# EAGLE design PCBCompost (EAGLE 9.6.2)
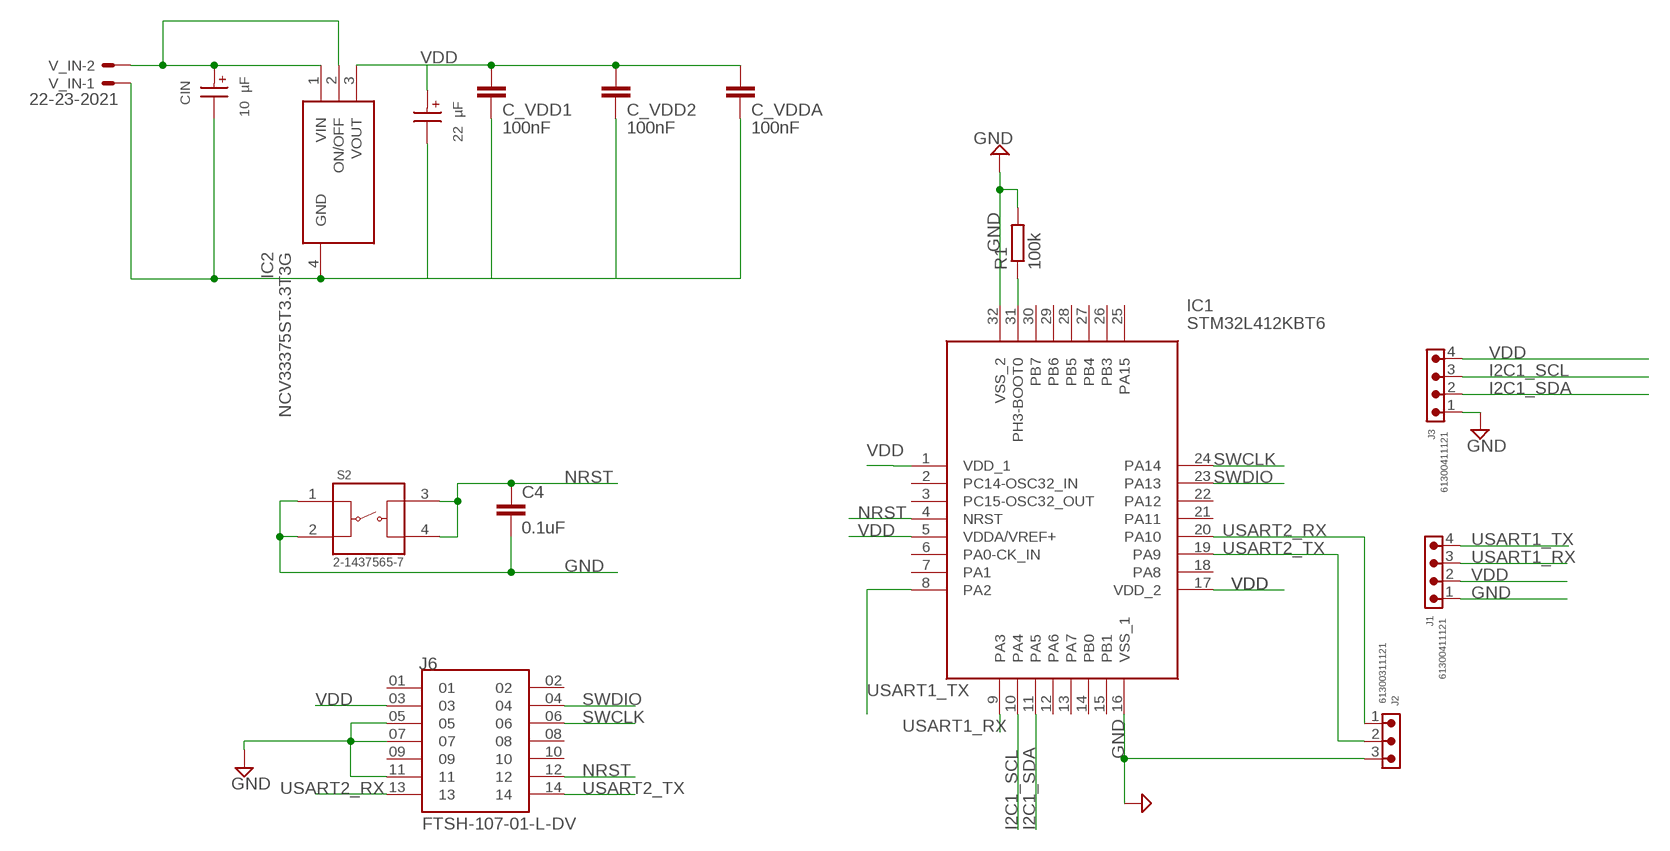
[diagram p0: schematic, sheet 1]

## Parts
C4  0.1uF  C-EUC0603  [C0603]
C_VDD1  100nF  C-EUC0603  [C0603]
C_VDD2  100nF  C-EUC0603  [C0603]
C_VDDA  100nF  C-EUC0603  [C0603]
CIN  10 µF  WCAP-ASLL_4X5.5_865060440001  [WCAP-ASLL_4X5.5(DXL)]
COUT  22 µF  WCAP-ASLL_5X5.5_865060442002  [WCAP-ASLL_5X5.5(DXL)]
IC1  STM32L412KBT6  [QFP80P900X900X160-32N]
IC2  NCV33375ST3.3T3G  [SOT230P700X175-4N]
J1  61300411121  6130XX11121_61300411121  [61300411121]
J2  61300311121  6130XX11121_61300311121  [61300311121]
J3  61300411121  6130XX11121_61300411121  [61300411121]
J6  FTSH-107-01-L-DV  [SAMTEC_FTSH-107-01-L-DV]
R1  100k  R-EU_R0603  [R0603]
S2  2-1437565-7  [SW_2-1437565-7]
V_IN  22-23-2021  [22-23-2021]

## Nets
GND: C4.2 C_VDD1.2 C_VDD2.2 C_VDDA.2 CIN.2(-) COUT.2(-) IC1.16(VSS_1) IC1.32(VSS_2) IC2.4(GND) J1.1 J2.3 J3.1 J6.05 J6.07 J6.11 R1.2 S2.1 S2.2 V_IN.1
I2C1_SCL: IC1.10(PA4) J3.3
I2C1_SDA: IC1.11(PA5) J3.2
N$1: IC1.31(PH3-BOOT0) R1.1
N$10: CIN.1(+) IC2.1(VIN) IC2.2(ON/OFF) V_IN.2
NRST: C4.1 IC1.4(NRST) J6.12 S2.3 S2.4
SWCLK: IC1.24(PA14) J6.06
SWDIO: IC1.23(PA13) J6.04
USART1_RX: IC1.9(PA3) J1.3
USART1_TX: IC1.8(PA2) J1.4
USART2_RX: IC1.20(PA10) J2.1 J6.13
USART2_TX: IC1.19(PA9) J2.2 J6.14
VDD: C_VDD1.1 C_VDD2.1 C_VDDA.1 COUT.1(+) IC1.1(VDD_1) IC1.5(VDDA/VREF+) IC1.17(VDD_2) IC2.3(VOUT) J1.2 J3.4 J6.03
Unconnected: IC1.2(PC14-OSC32_IN) IC1.3(PC15-OSC32_OUT) IC1.6(PA0-CK_IN) IC1.7(PA1) IC1.12(PA6) IC1.13(PA7) IC1.14(PB0) IC1.15(PB1) IC1.18(PA8) IC1.21(PA11) IC1.22(PA12) IC1.25(PA15) IC1.26(PB3) IC1.27(PB4) IC1.28(PB5) IC1.29(PB6) IC1.30(PB7) J6.01 J6.02 J6.08 J6.09 J6.10

## Library data of the parts
C4 C_VDD1 C_VDD2 C_VDDA = rcl:C-EU: CAPACITOR, European symbol; SPICEPREFIX: C
CIN = cin:WCAP-ASLL_4X5.5: WCAP-ASLL Aluminium Electrolytic Capacitors Low Impedance & Long Life +105 °C Characteristics Low impedance and long life product series Mounting style: V-Chip SMT Capacitance range: 1 µF ‒ 6800 µF Capacitance tolerance: ±20 % Voltage range (UR): 6.3 ‒ 450 V(DC) Operating temperature: -55 °C up to +105 °C for UR ≤ 100 V(DC) -40 °C up to +105 °C for UR > 100 V(DC) Endurance: 2000 ‒ 5000 h @ +105 °C Dimensions (DxL) in mm: 4.0 x 5.5 up to 16.0 x 17.0 Recommended soldering: Reflow soldering Applications Long life application & low impedance Input and output capacitor for switched-mode power supply Filtering Smoothing e.g. DC/DC converter, AC/DC converter, satellite receiver, control panel <https://www.we-online.com/catalog/media/o14724v209%20Family_WCAP-ASLL.jpg> Details see: https://www.we-online.com/catalog/en/WCAP-ASLL/ Updated by yingchun,Shan;2020-03-03 2020(C) Würth Elektronik; DATASHEET-URL: https://www.we-online.com/catalog/datasheet/865060440001.pdf; DF: 14%; DIAMETER: 4mm; I-LEAK: 3uA; I-RIPPLE: 90mA; L: 5.5mm; OPERATING-TEMPERATURE: -55 °C up to +105 °C; PART-NUMBER: 865060440001; TECHNICAL-REFERENCE: ASEB055100M025DVCTAB000; VR: 25V(DC); Z: 1.35Ohm
COUT = cout:WCAP-ASLL_5X5.5: WCAP-ASLL Aluminium Electrolytic Capacitors Low Impedance & Long Life +105 °C Characteristics Low impedance and long life product series Mounting style: V-Chip SMT Capacitance range: 1 µF ‒ 6800 µF Capacitance tolerance: ±20 % Voltage range (UR): 6.3 ‒ 450 V(DC) Operating temperature: -55 °C up to +105 °C for UR ≤ 100 V(DC) -40 °C up to +105 °C for UR > 100 V(DC) Endurance: 2000 ‒ 5000 h @ +105 °C Dimensions (DxL) in mm: 4.0 x 5.5 up to 16.0 x 17.0 Recommended soldering: Reflow soldering Applications Long life application & low impedance Input and output capacitor for switched-mode power supply Filtering Smoothing e.g. DC/DC converter, AC/DC converter, satellite receiver, control panel <https://www.we-online.com/catalog/media/o14724v209%20Family_WCAP-ASLL.jpg> Details see: https://www.we-online.com/catalog/en/WCAP-ASLL/ Updated by yingchun,Shan;2020-03-03 2020(C) Würth Elektronik; DATASHEET-URL: https://www.we-online.com/catalog/datasheet/865060442002.pdf; DF: 14%; DIAMETER: 5mm; I-LEAK: 5.5uA; I-RIPPLE: 150mA; L: 5.5mm; OPERATING-TEMPERATURE: -55 °C up to +105 °C; PART-NUMBER: 865060442002; TECHNICAL-REFERENCE: ASEC055220M025DVCTBB000; VR: 25V(DC); Z: 0.8Ohm
IC1 = STM32_librairy:STM32L412KBT6: ARM Microcontrollers - MCU Ultra-low-power Arm Cortex -M4 32-bit MCU+FPU, 100DMIPS up to 128KB Flash, 40KB SRAM, analog, ext. SMPS Source: Datasheet; DESCRIPTION: ARM Microcontrollers - MCU Ultra-low-power Arm Cortex -M4 32-bit MCU+FPU, 100DMIPS up to 128KB Flash, 40KB SRAM, analog, ext. SMPS; HEIGHT: 1.6mm; MANUFACTURER_NAME: STMicroelectronics; MANUFACTURER_PART_NUMBER: STM32L412KBT6; MOUSER_PART_NUMBER: 511-STM32L412KBT6; MOUSER_PRICE-STOCK: https://www.mouser.co.uk/ProductDetail/STMicroelectronics/STM32L412KBT6?qs=%252BEew9%252B0nqrD6o08jV%2F00TA%3D%3D
IC2 = SamacSys_Parts:NCV33375ST3.3T3G: ON SEMICONDUCTOR - NCV33375ST3.3T3G - Fixed LDO Voltage Regulator, 4.3V to 13V, 260mV Dropout, 3.3Vout, 300mAout, SOT-223-4 Source: Datasheet <http://www.onsemi.com/pub/Collateral/MC33375-D.PDF>; DESCRIPTION: ON SEMICONDUCTOR - NCV33375ST3.3T3G - Fixed LDO Voltage Regulator, 4.3V to 13V, 260mV Dropout, 3.3Vout, 300mAout, SOT-223-4; HEIGHT: 1.75mm; MANUFACTURER_NAME: onsemi; MANUFACTURER_PART_NUMBER: NCV33375ST3.3T3G; MOUSER_PART_NUMBER: 863-NCV33375ST3.3T3G; MOUSER_PRICE-STOCK: https://www.mouser.co.uk/ProductDetail/ON-Semiconductor/NCV33375ST33T3G?qs=Pqj8oIac8rWOl%252BM3OwXrOg%3D%3D
J1 J3 = Eagle_WR-PHD (rev21a):6130XX11121_61300411121: WR-PHD 2.54 mm THT Pin Header ARTICLE PROPERTIES: Pins:1;​ 2;​ 3;​ 4;​ 5;​ 6;​ 7;​ 8;​ 9;​ 10;​ 12;​ 13;​ 14;​ 15;​ 16;​ 18;​ 20;​ 22;​ 24;​ 25;​ 32;​ 36;​ 40 KIND PROPERTIES: Pitch：2.54 mm Quality Class:3 as per CECC 75 301-802 Rows：Single Gender：Pin Header Type：Straight MATERIAL PROPERTIES: Insulator Material :PBT Insulator Flammability Rating:UL94 V-0 Contact Material:Copper Alloy Contact Plating:Gold Contact Type:Stamped GENERAL INFORMATION Operating Temperature:-40 up to +105 °C Compliance:RoHS ELECTRICAL PROPERTIES: Rated Current:3 A IR 1:3 A Withstanding Voltage:500 V (AC) Contact Resistance:20 mΩ RISO:1000 MΩ CERTIFICATION UL Approval:E323964 PACKAGING PROPERTIES Packaging:Bag <https://katalog.we-online.com/media/images/v2/o33211v209%20Family_BTB_PHD_6130xx11121.jpg> Details see: https://katalog.we-online.com/en/em/PHD_2_54_THT_PIN_HEADER_6130XX11121 Updated by Yingchun,Shan 2019-10-16 2019 (C) Würth Elektronik; DATASHEET-URL: https://www.we-online.com/catalog/datasheet/61300411121.pdf; GENDER: Pin Header; IR: 3A; MOUNT: THT; PACKAGING: Bag; PART-NUMBER: 61300411121; PINS: 4; PITCH: 2.54mm; ROWS: Single; TYPE: Straight
J2 = Eagle_WR-PHD (rev21a):6130XX11121_61300311121: WR-PHD 2.54 mm THT Pin Header ARTICLE PROPERTIES: Pins:1;​ 2;​ 3;​ 4;​ 5;​ 6;​ 7;​ 8;​ 9;​ 10;​ 12;​ 13;​ 14;​ 15;​ 16;​ 18;​ 20;​ 22;​ 24;​ 25;​ 32;​ 36;​ 40 KIND PROPERTIES: Pitch：2.54 mm Quality Class:3 as per CECC 75 301-802 Rows：Single Gender：Pin Header Type：Straight MATERIAL PROPERTIES: Insulator Material :PBT Insulator Flammability Rating:UL94 V-0 Contact Material:Copper Alloy Contact Plating:Gold Contact Type:Stamped GENERAL INFORMATION Operating Temperature:-40 up to +105 °C Compliance:RoHS ELECTRICAL PROPERTIES: Rated Current:3 A IR 1:3 A Withstanding Voltage:500 V (AC) Contact Resistance:20 mΩ RISO:1000 MΩ CERTIFICATION UL Approval:E323964 PACKAGING PROPERTIES Packaging:Bag <https://katalog.we-online.com/media/images/v2/o33211v209%20Family_BTB_PHD_6130xx11121.jpg> Details see: https://katalog.we-online.com/en/em/PHD_2_54_THT_PIN_HEADER_6130XX11121 Updated by Yingchun,Shan 2019-10-16 2019 (C) Würth Elektronik; DATASHEET-URL: https://www.we-online.com/catalog/datasheet/61300311121.pdf; GENDER: Pin Header; IR: 3A; MOUNT: THT; PACKAGING: Bag; PART-NUMBER: 61300311121; PINS: 3; PITCH: 2.54mm; ROWS: Single; TYPE: Straight
J6 = FTSH-107-01-L-DV:FTSH-107-01-L-DV; MANUFACTURER: Samtec; PARTREV: R; STANDARD: Manufacturer Recommendations
R1 = rcl:R-EU_: RESISTOR, European symbol; SPICEPREFIX: R
S2 = 2-1437565-7:2-1437565-7: FSM2JSMA=SMT,TACTILE,PB SWITCH Check availability <https://pricing.snapeda.com/parts/FSM2JSMA/TE%20Connectivity/view-part?ref=eda>; AVAILABILITY: In Stock; COMMENT: 2-1437565-7; CONFIGURATION_POLE-THROW: Single Pole - Single Throw; CONTACT_CURRENT_RATING: 50 mA; DESCRIPTION: Tactile Switch SPST-NO Top Actuated Surface Mount; MF: TE Connectivity; MP: FSM2JSMA; PACKAGE: None; PRICE: None; PURCHASE-URL: https://pricing.snapeda.com/search/part/FSM2JSMA/?ref=eda
V_IN = con-molex:22-23-2021: .100" (2.54mm) Center Header - 2 Pin; MF: MOLEX; MPN: 22-23-2021; OC_FARNELL: 1462926; OC_NEWARK: 25C3832

## Board
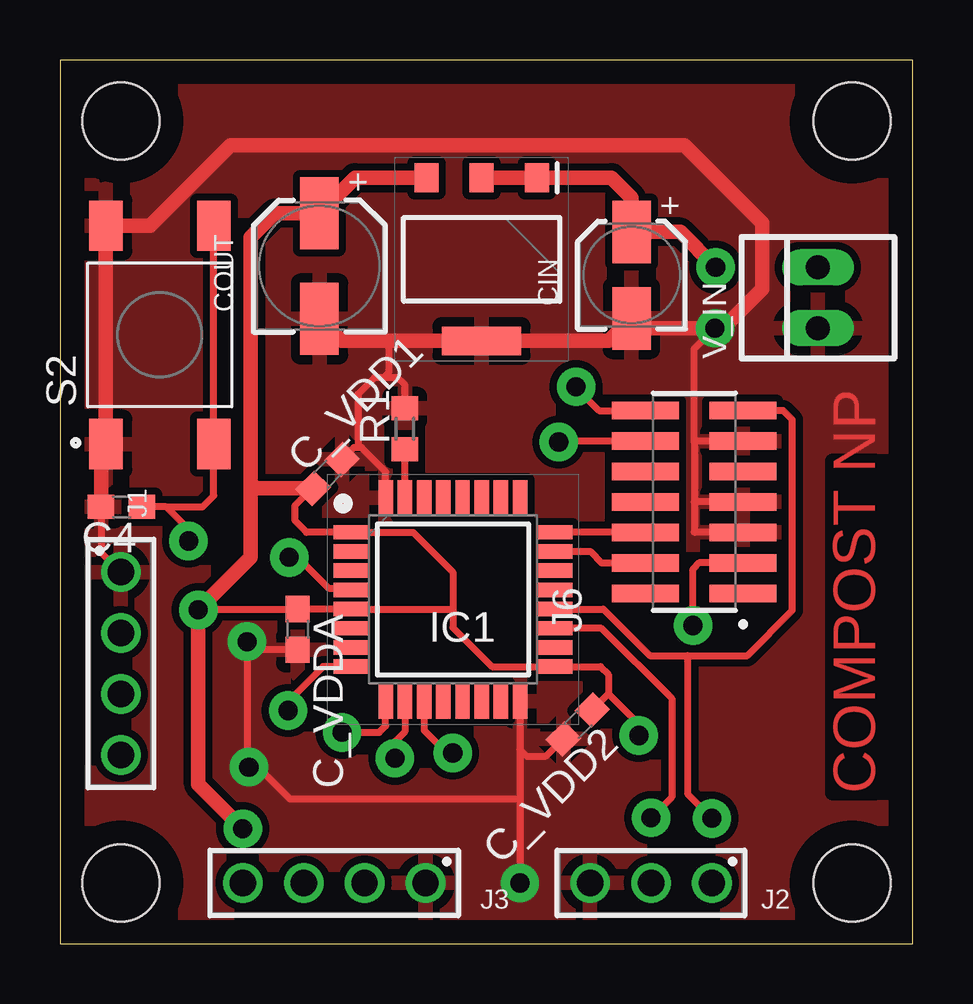
[diagram p1: board, top side]
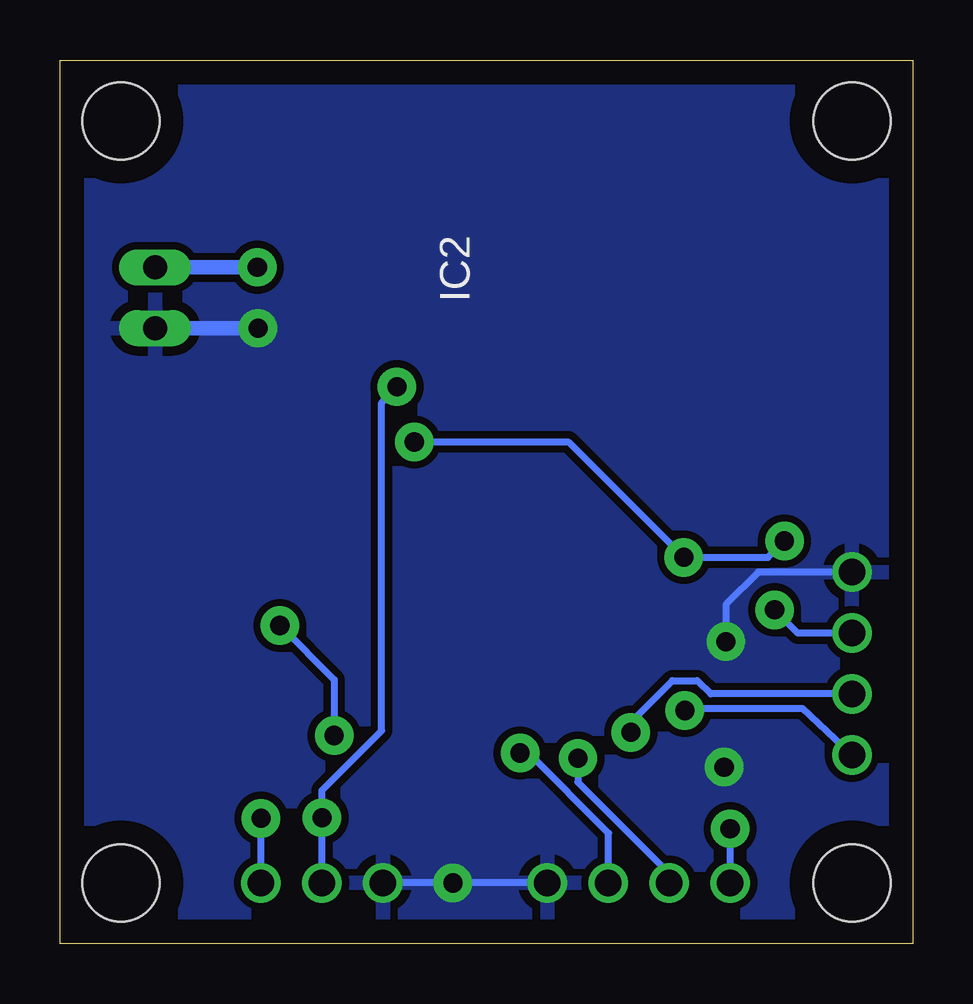
[diagram p2: board, bottom side, seen from below]

Size 35.56 x 36.83 mm. Coordinates in mm from the lower left corner, seen from the top.
Outline: 0,0 35.56,0 35.56,36.83 0,36.83 0,0
Copper layers (1*16): Top 0.035mm / dielectric 1.6mm / Bottom 0.035mm
Design rules "ENSEA_2022_04_08 *": minimum track width 0.3mm, minimum drill 0.8mm, track to track 0.3mm, track to pad 0.3mm, pad to pad 0.3mm, via to via 0.8mm, smd to smd 0.3mm, copper to edge 1mm, drill to drill 0.4mm, minimum pad ring 0.2mm, minimum via ring 0.2mm, stop-mask expansion 4mil, vias tented up to drill 0mil, thermal gap 0.4mm
Holes 3.2 mm at 2.54,2.54 2.54,34.29 33.02,34.29 33.02,2.54

### Footprints (pad centres in the part's own frame; a part is rotated, then mirrored left to right if it is on the bottom)
C0603 = smd 1.1 x 1: 1 -0.85,0; 2 0.85,0
WCAP-ASLL_4X5.5(DXL) = smd 2.6 x 1.6: 1 1.8,0; 2 -1.8,0
WCAP-ASLL_5X5.5(DXL) = smd 3 x 1.6: 1 2.2,0; 2 -2.2,0
QFP80P900X900X160-32N = smd 1.475 x 0.6: 1 -4.238,2.8; 2 -4.238,2; 3 -4.238,1.2; 4 -4.238,0.4; 5 -4.238,-0.4; 6 -4.238,-1.2; 7 -4.238,-2; 8 -4.238,-2.8; 17 4.238,-2.8; 18 4.238,-2; 19 4.238,-1.2; 20 4.238,-0.4; 21 4.238,0.4; 22 4.238,1.2; 23 4.238,2; 24 4.238,2.8 | smd 0.6 x 1.475: 9 -2.8,-4.238; 10 -2,-4.238; 11 -1.2,-4.238; 12 -0.4,-4.238; 13 0.4,-4.238; 14 1.2,-4.238; 15 2,-4.238; 16 2.8,-4.238; 25 2.8,4.238; 26 2,4.238; 27 1.2,4.238; 28 0.4,4.238; 29 -0.4,4.238; 30 -1.2,4.238; 31 -2,4.238; 32 -2.8,4.238
SOT230P700X175-4N = smd 1.2 x 1: 1 -3.4,2.3; 2 -3.4,0; 3 -3.4,-2.3 | smd 1.2 x 3.3: 4 3.4,0
61300411121 = drill 1.1: 1 -3.81,0; 2 -1.27,0; 3 1.27,0; 4 3.81,0
61300311121 = drill 1.1: 1 -2.54,0; 2 0,0; 3 2.54,0
SAMTEC_FTSH-107-01-L-DV = smd 0.74 x 2.79: 01 -3.81,-2.035; 02 -3.81,2.035; 03 -2.54,-2.035; 04 -2.54,2.035; 05 -1.27,-2.035; 06 -1.27,2.035; 07 0,-2.035; 08 0,2.035; 09 1.27,-2.035; 10 1.27,2.035; 11 2.54,-2.035; 12 2.54,2.035; 13 3.81,-2.035; 14 3.81,2.035
R0603 = smd 1 x 1.1: 1 -0.85,0; 2 0.85,0
SW_2-1437565-7 = smd 2.1 x 1.4: 1 -4.55,2.25; 2 4.55,2.25; 3 -4.55,-2.25; 4 4.55,-2.25
22-23-2021 = drill 1 long: 1 -1.27,0; 2 1.27,0

### Placement (x,y rotation side)
C4  2.57,18.21 180 top
C_VDD1  11.15,19.58 45 top
C_VDD2  21.59,9.14 225 top
C_VDDA  9.91,13.11 270 top
CIN  23.83,27.86 90 top
COUT  10.82,28.24 90 top
IC1  16.38,14.35 0 top
IC2  17.58,28.52 270 top
J1  2.54,11.68 270 top
J2  24.64,2.54 180 top
J3  11.43,2.54 180 top
J6  26.44,18.41 90 top
R1  14.38,21.46 90 top
S2  4.17,25.37 90 top
V_IN  31.6,26.92 90 top

### Tracks (layer width: path | path; a pad name or v marks a point on that pad's centre or on a via)
GND  (via drill 0.8 pad 1.6)
  Top 0.3: IC1.16 19.18,8.1 | 19.18,8.1 19.46,7.82 20.27,7.82 C_VDD2.2 | IC1.32 13.58,19.67 12.57,20.68 12.42,20.68 | C_VDD1.2 12.24,20.68 12.42,20.68 | R1.2 14.38,23.29 14.07,23.6 13.49,23.6 | 13.49,23.6 13.11,23.6 12.42,22.91 12.42,20.68 | J6.07 26.44,18.41 | J6.11 26.49,20.95 26.44,20.9 | 26.44,20.9 26.44,18.41 | 26.44,18.41 26.44,17.17 26.47,17.14 J6.05 | 1.92,18.41 C4.2 1.72,16.31 2.53,15.49 J1.1 | 19.18,8.1 19.18,8.09 19.18,6.04 | 19.18,6.04 v19.18,2.54 | C_VDDA.2 8.13,12.26 v7.8,12.59 7.8,7.82 9.58,6.04 19.18,6.04 | 13.49,23.6 13.72,23.82 13.72,25.12 | v27.3,25.65 26.44,24.79 26.44,20.9
  Top 0.6: 23.7,25.93 22.89,25.12 IC2.4 13.72,25.12 11.74,25.12 COUT.2 | 23.7,25.93 CIN.2 | 23.7,25.93 23.98,25.65 v27.3,25.65 27.64,25.65 29.29,27.3 29.29,30.02 26.03,33.28 7.12,33.28 3.77,29.93 S2.2 1.92,21.26 | 1.92,21.26 S2.1 | C4.2 1.72,21.06 1.92,21.26
  Bottom 0.3: J3.1 v19.18,2.54 J2.3 | J1.1 6.45,15.49 7.8,14.15 v7.8,12.59
  Bottom 0.6: V_IN.1 v27.3,25.65
  other vias: 7.87,7.37
  pour Top: 0,0 35.56,0 35.56,36.83 0,36.83
  pour Bottom: 0,0 35.56,0 35.56,36.83 0,36.83
I2C1_SCL  (via drill 0.8 pad 1.6)
  Top 0.3: IC1.10 14.38,8.85 13.97,8.43 v13.97,7.74
  Bottom 0.3: v13.97,7.74 13.97,6.74 10.16,2.93 J3.3
I2C1_SDA  (via drill 0.8 pad 1.6)
  Top 0.3: IC1.11 15.18,8.9 16.12,7.96 v16.38,7.96
  Bottom 0.3: J3.2 12.69,4.61 16.03,7.96 v16.38,7.96
N$1
  Top 0.3: IC1.31 R1.1
N$10  (via drill 0.8 pad 1.6)
  Top 0.6: IC2.2 IC2.1 22.99,31.92 23.82,31.09 CIN.1 25.86,29.66 v27.33,28.19
  Bottom 0.6: V_IN.2 v27.33,28.19
NRST  (via drill 0.8 pad 1.6)
  Top 0.3: 6.2,29.71 S2.4 S2.3 6.42,18.68 5.94,18.21 4.43,18.21 | IC1.4 12.1,14.8 11.22,14.8 9.91,16.11 v9.56,16.11 | v5.36,16.79 5.36,17.28 4.43,18.21 | 4.43,18.21 C4.1 | J6.12 20.8,20.95 20.78,20.93 v20.79,20.92
  Bottom 0.3: v5.36,16.79 6.04,16.11 v9.56,16.11 14.36,20.92 v20.79,20.92
SWCLK
  Top 0.3: J6.06 IC1.24
SWDIO
  Top 0.3: IC1.23 22.11,16.35 22.58,15.88 J6.04
USART1_RX  (via drill 0.8 pad 1.6)
  Top 0.3: v11.76,8.81 13.31,8.81 13.58,9.09 IC1.9
  Bottom 0.3: J1.3 8.43,10.41 8.99,10.97 10.03,10.97 11.76,9.25 v11.76,8.81
USART1_TX  (via drill 0.8 pad 1.6)
  Top 0.3: IC1.8 10.97,11.55 9.51,10.1 v9.51,9.72
  Bottom 0.3: v9.51,9.72 9.42,9.81 4.61,9.81 J1.4
USART2_RX  (via drill 0.8 pad 1.6)
  Top 0.3: IC1.20 22.65,13.95 24.59,12.01 26.16,12.01 | 26.16,12.01 26.18,12 26.18,6.23 v27.18,5.23 | 26.16,12.01 28.65,12.01 30.53,13.89 30.53,21.84 30.15,22.23 J6.13
  Bottom 0.3: J2.1 v27.18,5.23
USART2_TX  (via drill 0.8 pad 1.6)
  Top 0.3: v24.64,5.26 25.5,6.12 25.5,10.23 22.58,13.15 IC1.19 | v21.51,23.21 21.51,23.19 22.48,22.23 J6.14
  Bottom 0.3: J2.2 v24.64,5.26 24.64,6.4 22.15,8.89 22.15,22.55 21.51,23.19 v21.51,23.21
VDD  (via drill 0.8 pad 1.6)
  Top 0.3: 22.86,10.41 22.86,11.23 22.54,11.55 IC1.17 18.02,11.55 16.38,13.18 16.38,13.95 | 22.86,10.41 C_VDD2.1 | C_VDD1.1 10.5,18.98 9.8,18.29 9.8,17.63 10.28,17.15 IC1.1 14.73,17.15 16.38,15.49 16.38,13.95 | v5.77,13.92 9.87,13.92 C_VDDA.1 IC1.5 16.38,13.95 | J6.03 26.64,15.88 26.39,15.62 v26.39,13.27 | v24.13,8.69 24.13,9.14 22.86,10.41
  Top 0.6: IC2.3 12.3,31.92 COUT.1 8.96,30.45 7.95,29.44 7.95,19.19 | v7.62,4.8 5.77,6.66 v5.77,13.92 7.95,16.1 7.95,19.19 | 7.95,19.19 8.16,18.98 C_VDD1.1
  Bottom 0.3: J1.2 4.8,12.95 v5.77,13.92 | J3.4 v7.62,4.8 | v26.39,13.27 24.13,11.01 v24.13,8.69

### Text on the board
Top: COMPOST NP